# EAGLE design Charging Controller STM32 Base (EAGLE 9.6.2)
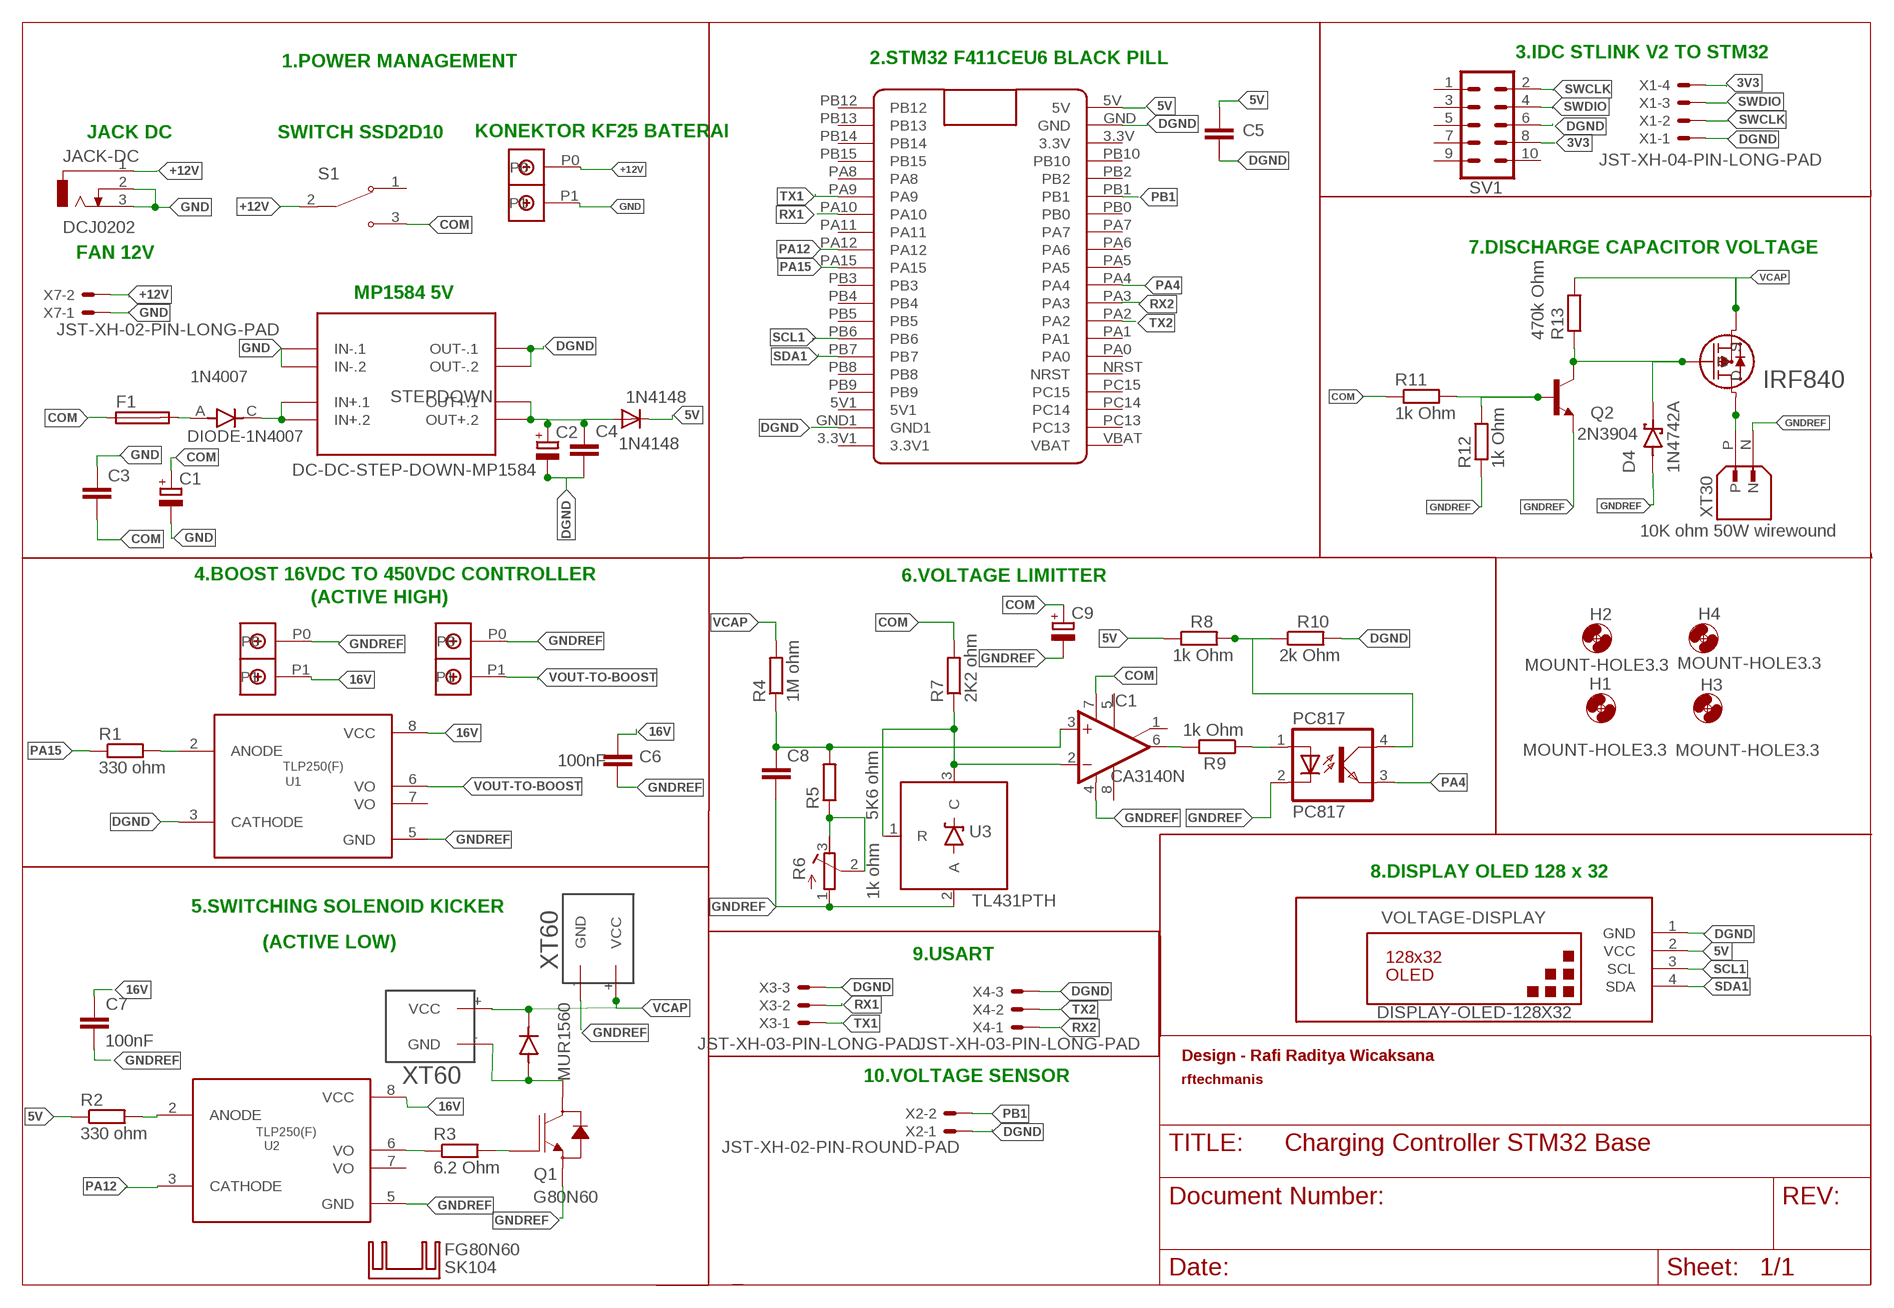
[diagram p0: schematic, sheet 1, part 1 of 2]
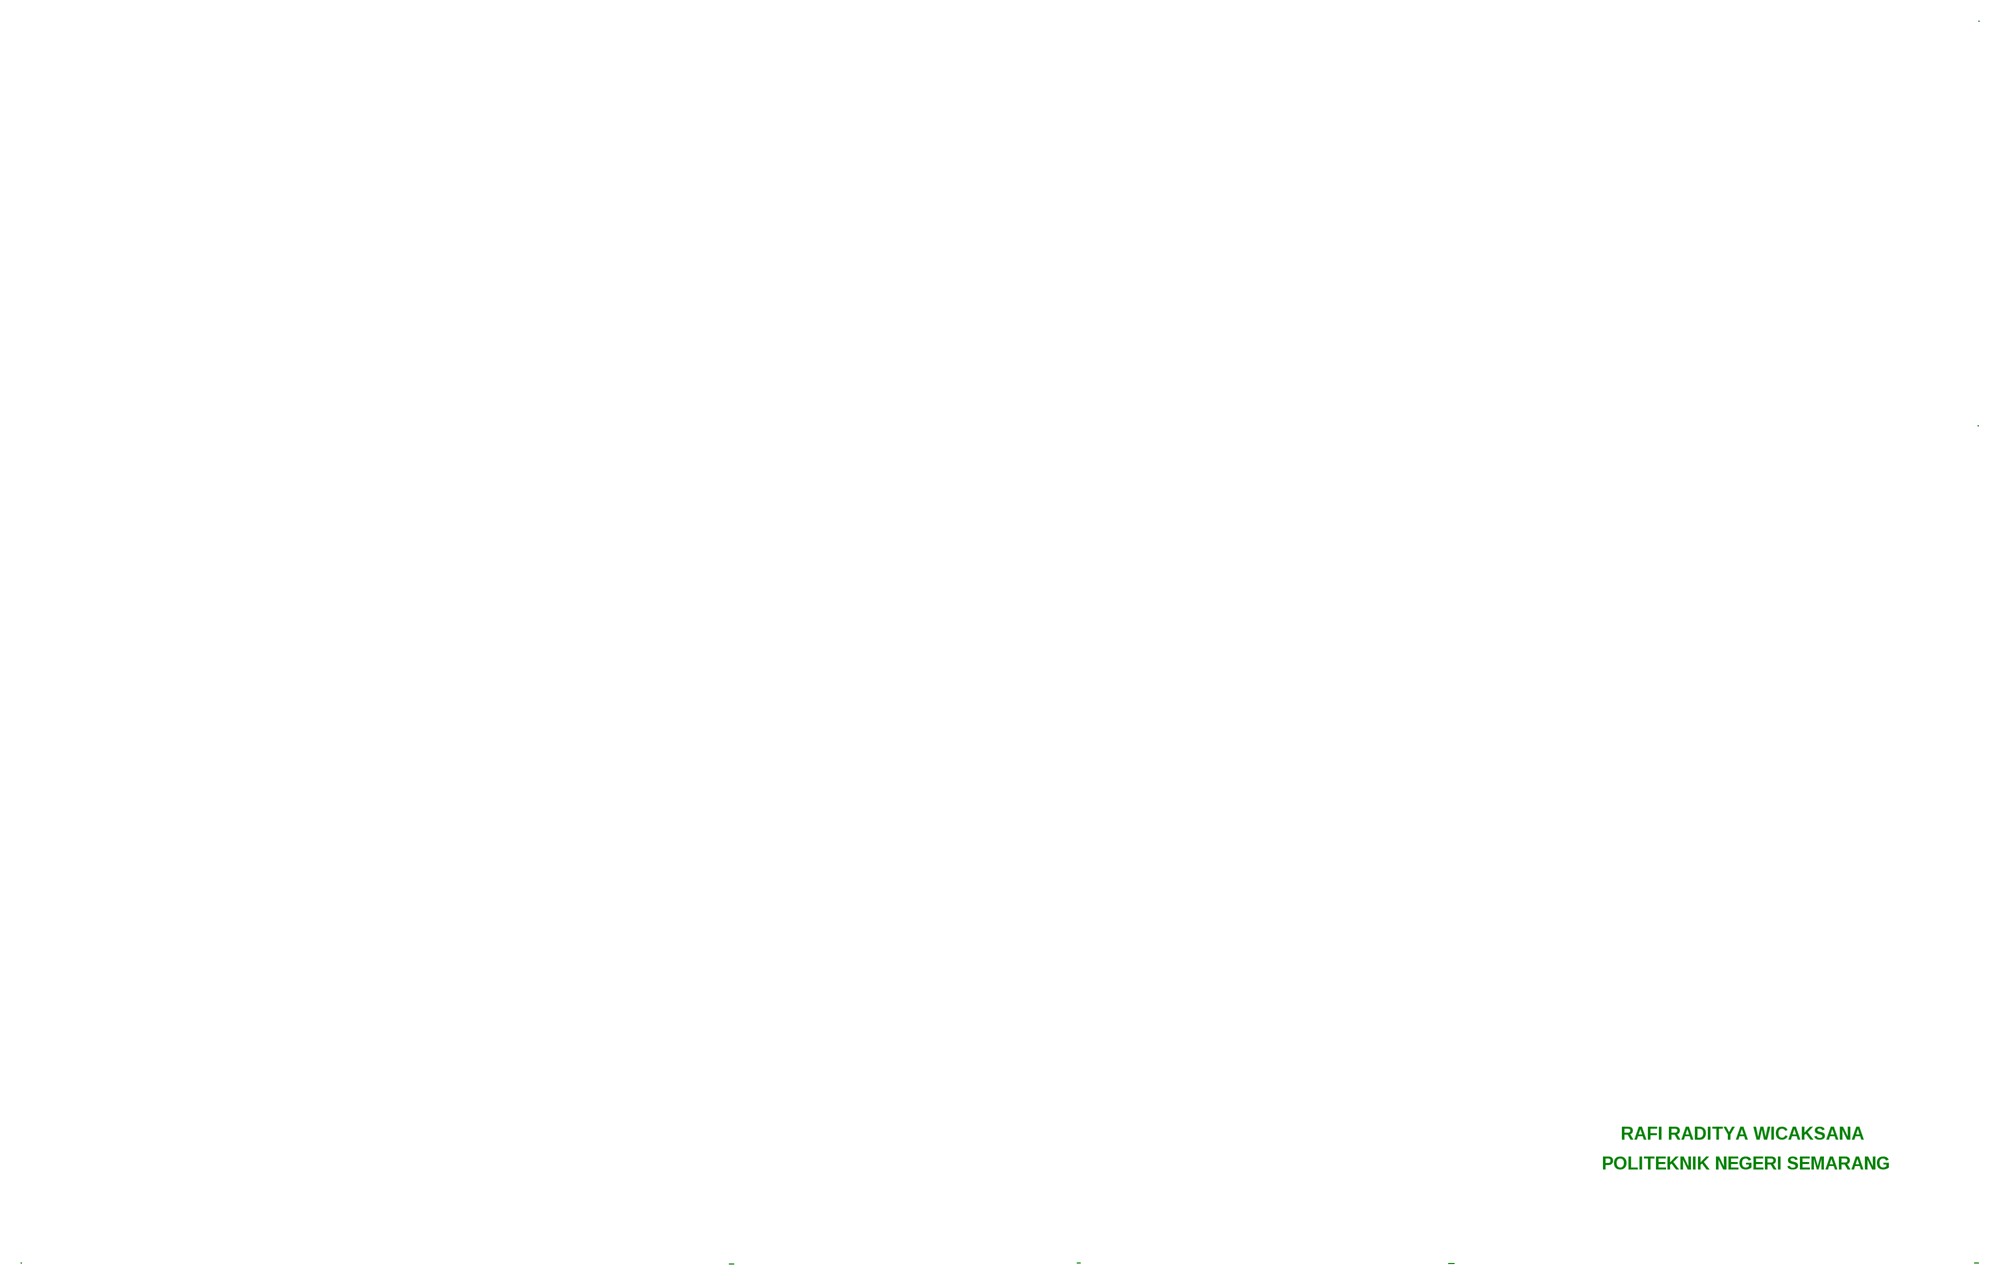
[diagram p1: schematic, sheet 1, part 2 of 2]

## Parts
1N4007  DIODE-1N4007  [DIOAD1060W80L520D270]
1N4148  1N4148  [DO35-10]
C1  CPOL-EUE3.5-8  [E3,5-8]
C2  CPOL-EUE3.5-8  [E3,5-8]
C3  C-EU050-030X075  [C050-030X075]
C4  C-EU050-030X075  [C050-030X075]
C5  C-EU050-030X075  [C050-030X075]
C6  100nF  C-EU050-030X075  [C050-030X075]
C7  100nF  C-EU050-030X075  [C050-030X075]
C8  C-EU050-035X075  [C050-035X075]
C9  CPOL-EUE2-5  [E2-5]
D4  1N4742A  [DIOAD1036W78L463D237]
F1  SH25  [SH25]
FG80N60  SK104  [SK104]
H1  MOUNT-HOLE3.3  [3,3]
H2  MOUNT-HOLE3.3  [3,3]
H3  MOUNT-HOLE3.3  [3,3]
H4  MOUNT-HOLE3.3  [3,3]
IC1  CA3140N  [DIL08]
JACK-DC  DCJ0202  [DCJ0202]
KF25_2PIN3  KF25_2PIN  [KF25_2PIN]
KF25_2PIN4  KF25_2PIN  [KF25_2PIN]
MUR1560  MUR1560  [TO508P997X444X1905-2]
PC817  PC817  [DIL04]
Q1  G80N60  [TO544P1613X521X2557-3]
Q2  2N3904  [TO92]
R1  330 ohm  R-EU_0204/7  [0204/7]
R2  330 ohm  R-EU_0204/7  [0204/7]
R3  6.2 Ohm  R-EU_0411/12  [0411/12]
R4  1M ohm  R-EU_0411/12  [0411/12]
R5  5K6 ohm  R-EU_0411/12  [0411/12]
R6  1k ohm  R-TRIMM64X  [RTRIM64X]
R7  2K2 ohm  R-EU_0207/10  [0207/10]
R8  1k Ohm  R-EU_0207/10  [0207/10]
R9  1k Ohm  R-EU_0207/10  [0207/10]
R10  2k Ohm  R-EU_0207/10  [0207/10]
R11  1k Ohm  R-EU_0204/7  [0204/7]
R12  1k Ohm  R-EU_0204/7  [0204/7]
R13  470k Ohm  R-EU_0204/7  [0204/7]
S1  1103M2S3CQE2  [SW_1103M2S3CQE2]
STEPDOWN  DC-DC-STEP-DOWN-MP1584  [DC-DC-STEP-DOWN-MP1584]
SV1  ML10  [ML10]
U1  TLP250(F)  [DIP1016W50P254L966H380Q8P]
U2  TLP250(F)  [DIP1016W50P254L966H380Q8P]
U3  TL431PTH  [TO-92]
U4  IRF840  [TO220AB_VIS]
U$2  KF25_2PIN  [KF25_2PIN]
U$3  BLACK_PILL  [BLACK_PILL]
U$4  XT60  [XT60]
U$5  XT60  [XT60]
VOLTAGE-DISPLAY  DISPLAY-OLED-128X32  [DISPLAY-OLED-128X32]
X1  JST-XH-04-PIN-LONG-PAD  [JST-XH-04-PACKAGE-LONG-PAD]
X2  JST-XH-02-PIN-ROUND-PAD  [JST-XH-02-PACKAGE-ROUND-PAD]
X3  JST-XH-03-PIN-LONG-PAD  [JST-XH-03-PACKAGE-LONG-PAD]
X4  JST-XH-03-PIN-LONG-PAD  [JST-XH-03-PACKAGE-LONG-PAD]
X7  JST-XH-02-PIN-LONG-PAD  [JST-XH-02-PACKAGE-LONG-PAD]
XT30  10K ohm 50W wirewound  XT30PW-M  [AMASS_XT30PW-M]

## Nets
3,3V: PC817.4(COL) R8.2 R10.1
3.3V: U$3.3.3V1
3V3: SV1.8 X1.4
5V: 1N4148.C C5.1 R2.1 R8.1 U$3.5V VOLTAGE-DISPLAY.2(VCC)
16V: C6.1 C7.1 KF25_2PIN3.P1 U1.8(VCC) U2.8(VCC)
+12V: JACK-DC.1 S1.2 U$2.P0 X7.2
COM: C1.+ C3.2 C9.+ F1.1 IC1.7(V+) R7.2 R11.1 S1.3
DGND: C2.- C4.2 C5.2 R10.2 STEPDOWN.OUT-.1 STEPDOWN.OUT-.2 SV1.6 U1.3(CATHODE) U$3.GND U$3.GND1 VOLTAGE-DISPLAY.1(GND) X1.1 X2.1 X3.3 X4.3
GND: C1.- C3.1 JACK-DC.2 JACK-DC.3 STEPDOWN.IN-.1 STEPDOWN.IN-.2 U$2.P1 X7.1
GNDREF: C6.2 C7.2 C8.2 C9.- D4.2(A) IC1.4(V-) KF25_2PIN3.P0 KF25_2PIN4.P0 PC817.2(C) Q1.3(E) Q2.3(E) R6.1(A) R12.1 U1.5(GND) U2.5(GND) U3.2(A) U$4.-(GND) XT30.N
N$1: 1N4007.C STEPDOWN.IN+.1 STEPDOWN.IN+.2
N$2: 1N4007.A F1.2
N$3: R1.2 U1.2(ANODE)
N$4: 1N4148.A C2.+ C4.1 STEPDOWN.OUT+.1 STEPDOWN.OUT+.2
N$5: R2.2 U2.2(ANODE)
N$6: MUR1560.3(A) Q1.2(C) U$5.-(GND)
N$7: R3.1 U2.6(VO)
N$8: Q1.1(G) R3.2
N$9: C8.1 IC1.3(+IN) R4.1 R5.2
N$10: R5.1 R6.2(S) R6.3(E)
N$11: IC1.2(-IN) R7.1 U3.1(R) U3.3(C)
N$12: IC1.6(OUT) R9.2
N$15: PC817.1(A) R9.1
N$17: Q2.2(B) R11.2 R12.2
N$18: D4.1(K) Q2.1(C) R13.1 U4.1(G)
N$19: U4.2(D) XT30.P
PA4: PC817.3(EMIT) U$3.PA4
PA12: U2.3(CATHODE) U$3.PA12
PA15: R1.1 U$3.PA15
PB1: U$3.PB1 X2.2
RX1: U$3.PA10 X3.2
RX2: U$3.PA3 X4.1
SCL1: U$3.PB6 VOLTAGE-DISPLAY.3(SCL)
SDA1: U$3.PB7 VOLTAGE-DISPLAY.4(SDA)
SWCLK: SV1.2 X1.2
SWDIO: SV1.4 X1.3
TX1: U$3.PA9 X3.1
TX2: U$3.PA2 X4.2
VCAP: MUR1560.1(K) R4.2 R13.2 U4.3(S) U$4.+(VCC) U$5.+(VCC)
VOUT-TO-BOOST: KF25_2PIN4.P1 U1.6(VO)
Unconnected: IC1.1(ON/CMP) IC1.5(ON) IC1.8(CMP) S1.1 SV1.1 SV1.3 SV1.5 SV1.7 SV1.9 SV1.10 U1.7(VO) U2.7(VO) U$3.3.3V U$3.5V1 U$3.NRST U$3.PA0 U$3.PA1 U$3.PA5 U$3.PA6 U$3.PA7 U$3.PA8 U$3.PA11 U$3.PB0 U$3.PB2 U$3.PB3 U$3.PB4 U$3.PB5 U$3.PB8 U$3.PB9 U$3.PB10 U$3.PB12 U$3.PB13 U$3.PB14 U$3.PB15 U$3.PC13 U$3.PC14 U$3.PC15 U$3.VBAT

## Notes on the sheet
- 3.IDC STLINK V2 TO STM32
- 1.POWER MANAGEMENT | 2.STM32 F411CEU6 BLACK PILL
- JACK DC | SWITCH SSD2D10 | KONEKTOR KF25 BATERAI
- FAN 12V | 7.DISCHARGE CAPACITOR VOLTAGE
- MP1584 5V
- 4.BOOST 16VDC TO 450VDC CONTROLLER | 6.VOLTAGE LIMITTER
- (ACTIVE HIGH)
- 8.DISPLAY OLED 128 x 32
- 5.SWITCHING SOLENOID KICKER
- (ACTIVE LOW)
- 9.USART
- Design - Rafi Raditya Wicaksana
- 10.VOLTAGE SENSOR | rftechmanis
- RAFI RADITYA WICAKSANA
- POLITEKNIK NEGERI SEMARANG

## Library data of the parts
1N4007 = Polirevo_2024:DIODE-1N4007: Diode Switching 1KV 1A 2-Pin DO-41 Check availability; AVAILABILITY: In Stock; CHECK_PRICES: https://www.snapeda.com/parts/1N4007/Diotec/view-part/?ref=eda; DESCRIPTION: Diode, DO-41, 1000V, 1A, 175°C; MF: Diotec Semiconductor; MP: 1N4007; PACKAGE: DO-41 Diotec; PRICE: None; SNAPEDA_LINK: https://www.snapeda.com/parts/1N4007/Diotec/view-part/?ref=snap
1N4148 = diode:1N4148: DIODE high speed (Philips)
C1 C2 C9 = rcl:CPOL-EU: POLARIZED CAPACITOR, European symbol; SPICEPREFIX: C
C3-C8 = rcl:C-EU: CAPACITOR, European symbol; SPICEPREFIX: C
D4 = 1N4742A:1N4742A: Check availability; AVAILABILITY: In Stock; CHECK_PRICES: https://www.snapeda.com/parts/1N4742A/Onsemi/view-part/?ref=eda; DESCRIPTION: Zener Diode 12 V 1 W ±5% Through Hole DO-204AL (DO-41); MF: ON; MP: 1N4742A; PACKAGE: DO-41 Fairchild Semiconductor; PRICE: None; SNAPEDA_LINK: https://www.snapeda.com/parts/1N4742A/Onsemi/view-part/?ref=snap
F1 = fuse:SH25: FUSE HOLDER grid 25 mm, OGN0031 8211, Schurter (Buerklin); MF: SCHURTER; MPN: 0031.8211; OC_FARNELL: 1162741; OC_NEWARK: 96B9380
FG80N60 = heatsink:SK104: HEATSINK manufacturer Fischer/distributor Buerklin
H1-H4 = holes:MOUNT-HOLE: MOUNTING HOLE with drill center marker
IC1 = linear:CA3140: OP AMP
JACK-DC = con-jack:DCJ0202: DC POWER JACK Source: DCJ0202.pdf; OC_FARNELL: unknown; OC_NEWARK: unknown
KF25_2PIN3 KF25_2PIN4 U$2 = KF25_2PIN:KF25_2PIN
MUR1560 = MUR1560:MUR1560: Diode Standard 600V 15A Through Hole TO-220AC Check availability; AVAILABILITY: Not in stock; CHECK_PRICES: https://www.snapeda.com/parts/MUR1560/Diotec/view-part/?ref=eda; DESCRIPTION: Diode, Superfast, TO-220AC, 600V, 15A, 50ns, 175°C; MF: Diotec Semiconductor; MP: MUR1560; PACKAGE: TO-220AC Diotec; PRICE: None; PURCHASE-URL: https://www.snapeda.com/api/url_track_click_mouser/?unipart_id=10223036&manufacturer=Diotec Semiconductor&part_name=MUR1560&search_term=mur1560; SNAPEDA_LINK: https://www.snapeda.com/parts/MUR1560/Diotec/view-part/?ref=snap
PC817 = optocoupler-2:PC817: SHARP OPTO COUPLER
Q1 = FGH80N60FDTU:G80N60: Check availability; AVAILABILITY: In Stock; CHECK_PRICES: https://www.snapeda.com/parts/IHW30N160R5XKSA1/Infineon/view-part/?ref=eda; DESCRIPTION: IGBT Trench Field Stop 1600 V 60 A 263 W Through Hole PG-TO247-3; MF: Infineon Technologies; MP: G80N60; PACKAGE: TO-247-3 Infineon Technologies; PRICE: None; SNAPEDA_LINK: https://www.snapeda.com/parts/IHW30N160R5XKSA1/Infineon/view-part/?ref=snap
Q2 = transistor-npn:2N3904: NPN Transistor
R1-R5 R7-R13 = rcl:R-EU_: RESISTOR, European symbol; SPICEPREFIX: R
R6 = rcl:R-TRIMM: Trimm resistor; SPICEMODEL: X; SPICEPREFIXL: POT
S1 = Slide-Switch1103M23CQE2:1103M2S3CQE2: Check availability Check availability; AVAILABILITY: In Stock; CHECK_PRICES: https://www.snapeda.com/parts/1103M2S3CQE2/C%2526K/view-part/?ref=eda; DESCRIPTION: Slide Switch SPDT Through Hole; MF: C&K; MP: 1103M2S3CQE2; PACKAGE: None; PRICE: None; SNAPEDA_LINK: https://www.snapeda.com/parts/1103M2S3CQE2/C%2526K/view-part/?ref=snap
STEPDOWN = diy-modules:DC-DC-STEP-DOWN-MP1584: DC/DC Step-Down Regulator based on MP1584 chip MP1584 datasheet available here: http://www.haoyuelectronics.com/Attachment/MP1584/MP1584.pdf Click here to find device on ebay.com
SV1 = con-harting-ml:ML10: HARTING; OC_FARNELL: unknown; OC_NEWARK: unknown
U1 U2 = TLP250_F_:TLP250(F): Optocoupler; THT; Out: IGBT driver; 2.5kV; DIP8; 1.5A Check availability; AVAILABILITY: In Stock; CHECK_PRICES: https://www.snapeda.com/parts/TLP250(F)/Toshiba+Semiconductor+and+Storage/view-part/?ref=eda; DESCRIPTION: 1.5A Gate Driver Optical Coupling 2500Vrms 1 Channel 8-DIP; MF: Toshiba; MP: TLP250(F); PACKAGE: DIP-8 Toshiba; PRICE: None; SNAPEDA_LINK: https://www.snapeda.com/parts/TLP250(F)/Toshiba+Semiconductor+and+Storage/view-part/?ref=snap
U3 = TL431:TL431: Check availability; AVAILABILITY: Not in stock; CHECK_PRICES: https://www.snapeda.com/parts/TL431/Onsemi/view-part/?ref=eda; DESCRIPTION: IC VREF SHUNT ADJ 0.4% TO92-3; MF: onsemi; MP: TL431; PACKAGE: None; PRICE: None; SNAPEDA_LINK: https://www.snapeda.com/parts/TL431/Onsemi/view-part/?ref=snap
U4 = IRF840:IRF840; COPYRIGHT: Copyright (C) 2026 Ultra Librarian. All rights reserved.; MANUFACTURER_NAME: Vishay; MANUFACTURER_PART_NUMBER: IRF840
U$3 = STM32-F4-BlackPill:BLACK_PILL: STM32F401CC and STM32f411CE based WeAct Black Pill (rev 3.0)
U$4 U$5 = XT60:XT60: XT60
VOLTAGE-DISPLAY = diy-modules:DISPLAY-OLED-128X32: 128x32 Dot Matrix OLED Module with I2C interface based on SSD1306 chip More details available here: http://www.tinyosshop.com/index.php?route=product/product&product_id=953 Schematic available here: http://www.tinyosshop.com/datasheet/OLED%2012832.pdf SSD1306 datasheet: https://cdn-shop.adafruit.com/datasheets/SSD1306.pdf Click here to find device on ebay.com
X1 = JST XH Connectors v1-0:JST-XH-04-PIN: JST XH Connector 2 Pin Wire to board connector. Pitch: 2,54 mm, (0.100") Number of pins: 4 Created by Rembrandt Electronics www.rembrandtelectronics.com
X2 X7 = JST XH Connectors v1-0:JST-XH-02-PIN: JST XH Connector 2 Pin Wire to board connector. Pitch: 2,54 mm, (0.100") Number of pins: 2 Created by Rembrandt Electronics www.rembrandtelectronics.com
X3 X4 = JST XH Connectors v1-0:JST-XH-03-PIN: JST XH Connector 2 Pin Wire to board connector. Pitch: 2,54 mm, (0.100") Number of pins: 3 Created by Rembrandt Electronics www.rembrandtelectronics.com
XT30 = XT30PW-M:XT30PW-M: Check availability; AVAILABILITY: In Stock; CHECK_PRICES: https://www.snapeda.com/parts/XT30PW-M/AMASS/view-part/?ref=eda; DESCRIPTION: Socket; DC supply; XT30; male; PIN: 2; on PCBs; THT; Colour: yellow; MF: AMASS; MP: XT30PW-M; PACKAGE: None; PRICE: None; SNAPEDA_LINK: https://www.snapeda.com/parts/XT30PW-M/AMASS/view-part/?ref=snap

## Board
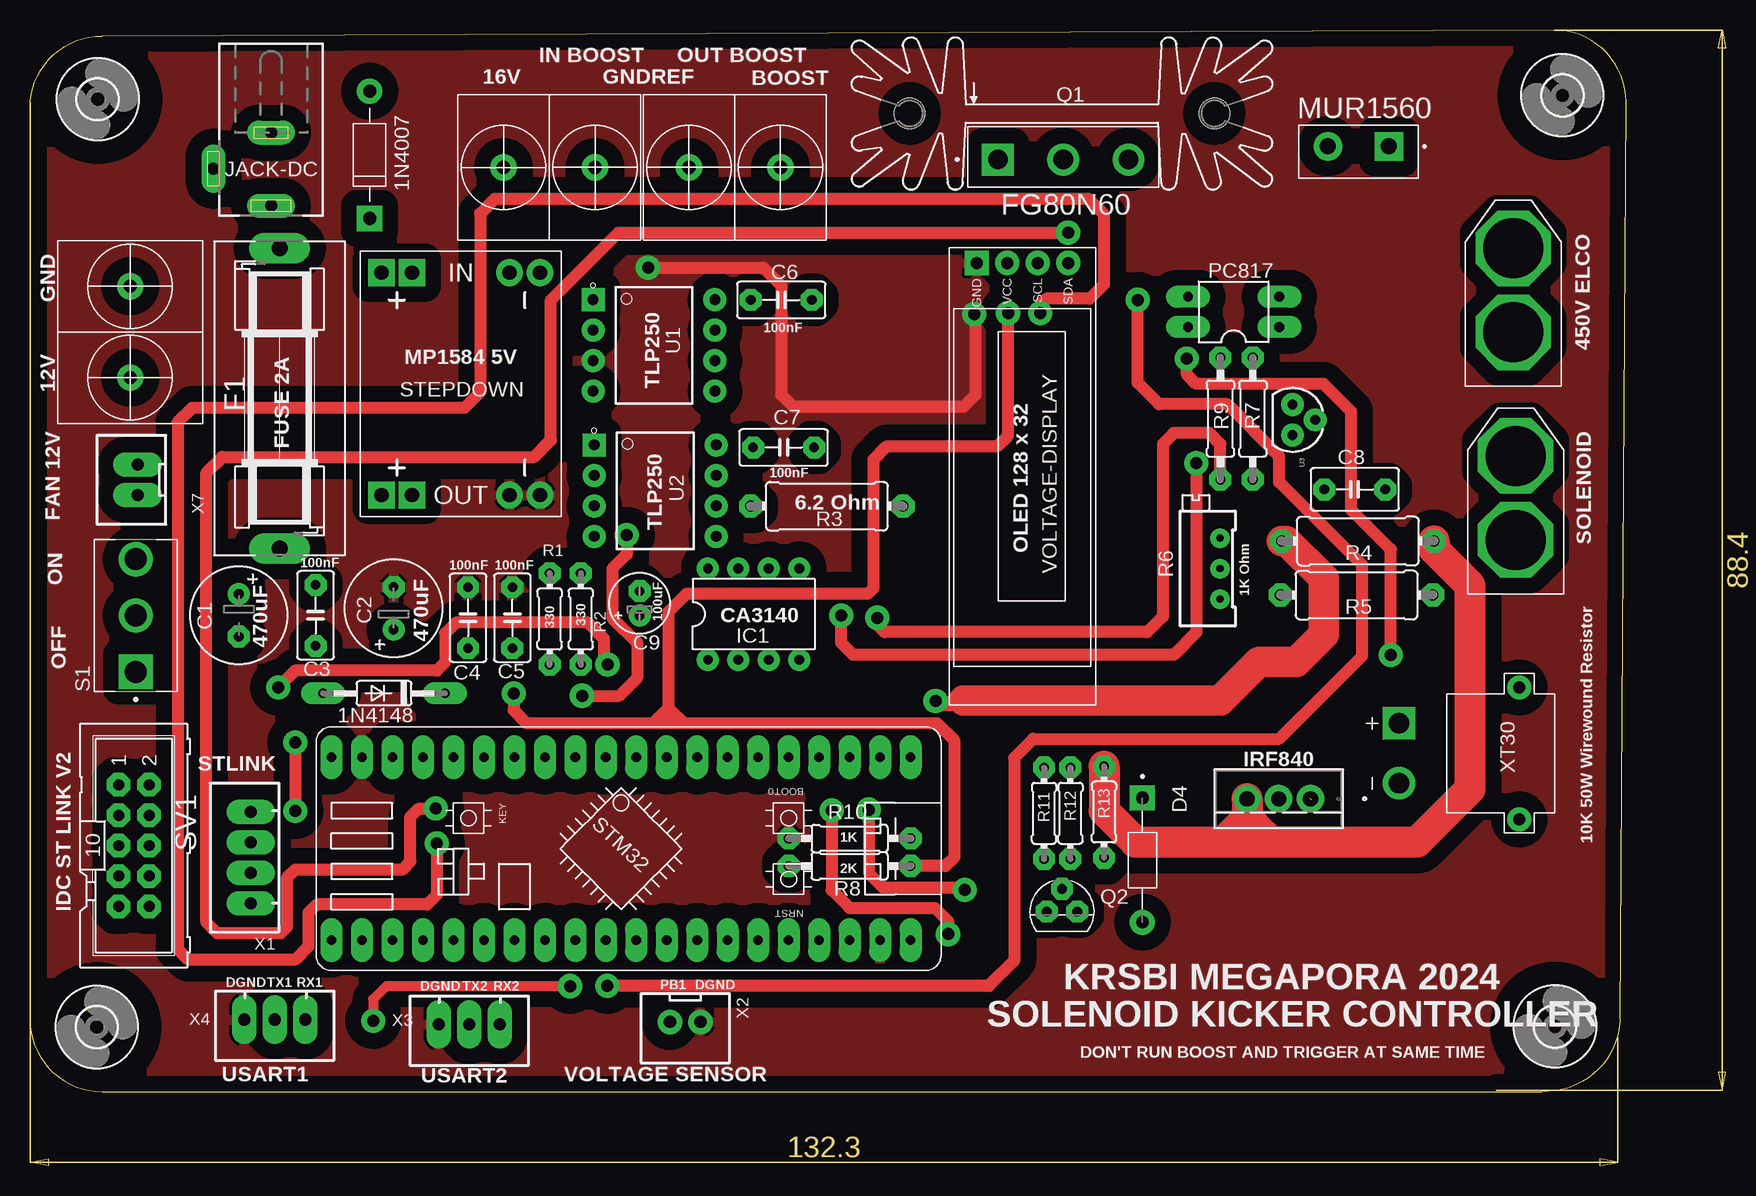
[diagram p2: board, top side]
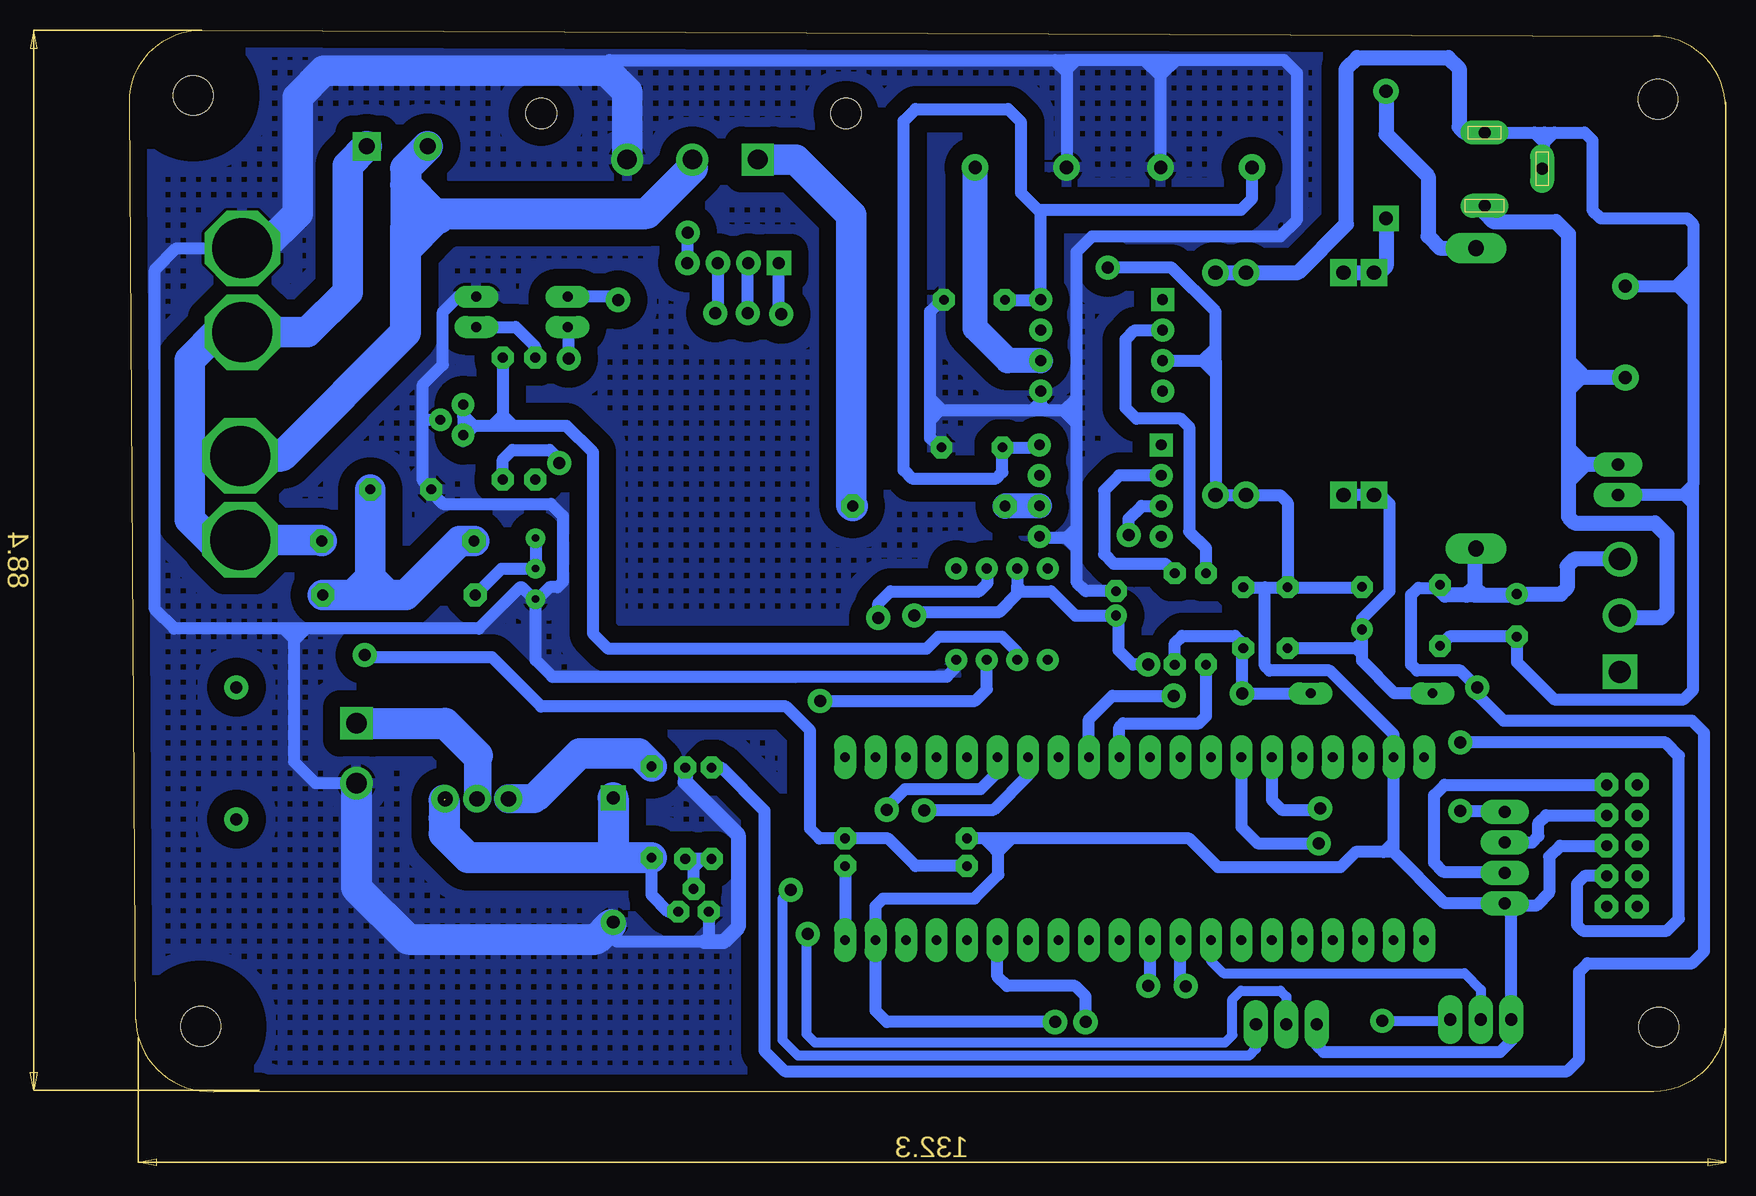
[diagram p3: board, bottom side, seen from below]

Size 133 x 88.5 mm. Coordinates in mm from the lower left corner, seen from the top.
Outline: 6,0 126,0 arc90 132.5,6 133,82.5 arc90 127,88.5 6,88 arc90 0,82 0,6 arc90 6,0
Copper layers (1*16): Top 0.035mm / dielectric 1.5mm / Bottom 0.035mm
Design rules "default *": minimum track width 6mil, minimum drill 0.35mm, track to track 6mil, track to pad 6mil, pad to pad 6mil, via to via 6mil, smd to smd 6mil, copper to edge 40mil, drill to drill 6mil, minimum pad ring 20mil, minimum via ring 20mil, stop-mask expansion 4mil, vias tented up to drill 0mil, thermal gap 10mil

### Footprints (pad centres in the part's own frame; a part is rotated, then mirrored left to right if it is on the bottom)
DIOAD1060W80L520D270 = drill 1.1 pad 1.65: A 5.3,0 | drill 1.1 pad 1.65 square: C -5.3,0
DO35-10 = drill 0.813 long: A 5.08,0; C -5.08,0
E3,5-8 = drill 0.813 pad 1.6: + -1.778,0 | drill 0.813 pad 1.6 octagon: - 1.778,0
C050-030X075 = drill 0.813 octagon: 1 -2.54,0; 2 2.54,0
C050-035X075 = drill 0.813 octagon: 1 -2.54,0; 2 2.54,0
E2-5 = drill 0.813 pad 1.27: + -1.016,0 | drill 0.813 pad 1.27 octagon: - 1.016,0
DIOAD1036W78L463D237 = drill 1.06 pad 1.59 square: 1 -5.18,0 | drill 1.06 pad 1.59: 2 5.18,0
SH25 = drill 1.321 pad 2.54 long: 1 -12.522,0; 2 12.522,0
SK104 = hole 2.54: -12.7,-0.762; 12.7,-0.762
3,3 = hole 3.3: 0,0
DIL08 = drill 0.813 pad 1.27: 1 -3.81,-3.81; 2 -1.27,-3.81; 3 1.27,-3.81; 4 3.81,-3.81; 5 3.81,3.81; 6 1.27,3.81; 7 -1.27,3.81; 8 -3.81,3.81
DCJ0202 = drill 1 pad 2 long: 1 0,3.1; 2 4.8,0; 3 0,-3
KF25_2PIN = drill 1.1 pad 2.2: P0 3.82,6.05; P1 11.44,6.05
TO508P997X444X1905-2 = drill 1.34 pad 2.01 square: 1 -2.54,0 | drill 1.34 pad 2.01: 3 2.54,0
DIL04 = drill 0.813 long: 1 -1.27,-3.81; 2 1.27,-3.81; 3 1.27,3.81; 4 -1.27,3.81
TO544P1613X521X2557-3 = drill 1.64 pad 2.46 square: 1 -5.44,0 | drill 1.64 pad 2.46: 2 0,0; 3 5.44,0
TO92 = drill 0.813 octagon: 1 1.27,0; 2 0,1.905; 3 -1.27,0
0204/7 = drill 0.813 octagon: 1 -3.81,0; 2 3.81,0
0411/12 = drill 0.914 octagon: 1 -6.35,0; 2 6.35,0
RTRIM64X = drill 0.61: 1 1.27,-2.54; 2 1.27,0; 3 1.27,2.54
0207/10 = drill 0.813 octagon: 1 -5.08,0; 2 5.08,0
SW_1103M2S3CQE2 = drill 1.85 square: 1 -4.7,0 | drill 1.85: 2 0,0; 3 4.7,0
DC-DC-STEP-DOWN-MP1584 = drill 1.2 pad 2 square: IN+.1 -9.271,-4.064; IN+.2 -9.271,-6.604; OUT+.1 9.271,-4.064; OUT+.2 9.271,-6.604 | drill 1.2 pad 2: IN-.1 -9.271,6.604; IN-.2 -9.271,4.064; OUT-.1 9.271,6.604; OUT-.2 9.271,4.064
ML10 = drill 0.914 octagon: 1 -5.08,-1.27; 2 -5.08,1.27; 3 -2.54,-1.27; 4 -2.54,1.27; 5 0,-1.27; 6 0,1.27; 7 2.54,-1.27; 8 2.54,1.27; 9 5.08,-1.27; 10 5.08,1.27
DIP1016W50P254L966H380Q8P = drill 0.9 pad 1.5 square: 1 -5.08,3.81 | drill 0.9 pad 1.5: 2 -5.08,1.27; 3 -5.08,-1.27; 4 -5.08,-3.81; 5 5.08,-3.81; 6 5.08,-1.27; 7 5.08,1.27; 8 5.08,3.81
TO-92 = drill 0.813 pad 1.88: 1 -1.27,0; 2 0,1.905; 3 1.27,0
TO220AB_VIS = drill 1.27 pad 1.778: 1 0,0; 2 2.642,0; 3 5.283,0
BLACK_PILL = drill 0.8 long: 3.3V 7.62,10.16; 3.3V1 -7.62,-33.02; 5V 7.62,15.24; 5V1 -7.62,-27.94; GND 7.62,12.7; GND1 -7.62,-30.48; NRST 7.62,-22.86; PA0 7.62,-20.32; PA1 7.62,-17.78; PA2 7.62,-15.24; PA3 7.62,-12.7; PA4 7.62,-10.16; PA5 7.62,-7.62; PA6 7.62,-5.08; PA7 7.62,-2.54; PA8 -7.62,5.08; PA9 -7.62,2.54; PA10 -7.62,0; PA11 -7.62,-2.54; PA12 -7.62,-5.08; PA15 -7.62,-7.62; PB0 7.62,0; PB1 7.62,2.54; PB2 7.62,5.08; PB3 -7.62,-10.16; PB4 -7.62,-12.7; PB5 -7.62,-15.24; PB6 -7.62,-17.78; PB7 -7.62,-20.32; PB8 -7.62,-22.86; PB9 -7.62,-25.4; PB10 7.62,7.62; PB12 -7.62,15.24; PB13 -7.62,12.7; PB14 -7.62,10.16; PB15 -7.62,7.62; PC13 7.62,-30.48; PC14 7.62,-27.94; PC15 7.62,-25.4; VBAT 7.62,-33.02
XT60 = drill 5 octagon: + 4.5,0; - 11.5,0
DISPLAY-OLED-128X32 = drill 1 square: 1 -17.78,-3.81 | drill 1: 2 -17.78,-1.27; 3 -17.78,1.27; 4 -17.78,3.81
JST-XH-04-PACKAGE-LONG-PAD = drill 1.016 long: 1 -3.81,0; 2 -1.27,0; 3 1.27,0; 4 3.81,0
JST-XH-02-PACKAGE-ROUND-PAD = drill 1.016: 1 -1.27,0; 2 1.27,0
JST-XH-03-PACKAGE-LONG-PAD = drill 1.016 long: 1 -2.54,0; 2 0,0; 3 2.54,0
JST-XH-02-PACKAGE-LONG-PAD = drill 1.016 long: 1 -1.27,0; 2 1.27,0
AMASS_XT30PW-M = drill 1.7: N 2.5,-10 | drill 1.7 square: P -2.5,-10 | drill 1: S1 5.5,0; S2 -5.5,0

### Placement (x,y rotation side)
1N4007  28.3,78.1 90 top
1N4148  29.5,33.2 180 top
C1  17.4,39.7 270 top
C2  30.3,40.3 90 top
C3  23.8,39.7 90 top
C4  36.5,39.5 90 top
C5  40.2,39.5 90 top
C6  62.6,66 0 top
C7  62.8,53.7 0 top
C8  110.4,50.2 180 top
C9  50.8,40.7 90 top
D4  92.7,19.3 270 top
F1  20.8,57.8 90 top
FG80N60  86,82.3 0 top
H1  5.64,82.73 0 top
H2  127.7,83.05 0 top
H3  5.56,5.37 0 top
H4  127.08,5.43 0 top
IC1  60.3,39.8 0 top
JACK-DC  20.09,76.94 180 top
KF25_2PIN3  50.9,83.1 180 top
KF25_2PIN4  51.1,71 0 top
MUR1560  110.7,78.8 180 top
PC817  100.3,65 90 top
Q1  86.1,77.7 0 top
Q2  86,15 0 top
R1  43.3,39.4 90 top
R2  45.9,39.4 90 top
R3  66.4,48.8 0 top
R4  110.65,45.9 0 top
R5  110.55,41.4 0 top
R6  97.9,43.6 0 top
R7  101.9,56.1 270 top
R8  68.3,18.8 180 top
R9  99.2,56.1 270 top
R10  68.3,21.1 180 top
R11  84.5,23.2 270 top
R12  86.7,23.2 270 top
R13  89.5,23.3 90 top
S1  8.81,39.69 90 top
STEPDOWN  35.9,59 270 top
SV1  8.65,20.5 270 top
U1  52,62.2 0 top
U2  52.1,50.1 0 top
U3  105.2,56 270 top
U4  106.7,24.4 180 top
U$2  14.4,55.7 90 top
U$3  58.14,20.25 270 top
U$4  123.6,58.8 90 top
U$5  123.8,41.5 90 top
VOLTAGE-DISPLAY  82.7,51.3 270 top
X1  18.4,19.5 90 top
X2  54.6,5.8 180 top
X3  36.6,5.6 180 top
X4  20.4,6 180 top
X7  8.97,51 90 top
XT30  124.1,28.2 270 top

### Tracks (layer width: path | path; a pad name or v marks a point on that pad's centre or on a via)
3,3V  (via drill 1)
  Top 1.016: v113.4,36.4 113.4,45.2 110.1,48.5 110.1,56.7 107.8,59 97.2,59 96.4,59.8 v96.4,61.1
  Bottom 1.016: R8.2 67.5,18.8 69.8,21.1 R10.1 75.5,21.1 76.3,21.9 76.3,30.1 78.3,32.1 98.7,32.1 102.8,36.2 113.2,36.2 v113.4,36.4 | v96.4,61.1 96.4,63.64 PC817.4
3V3  (via drill 1)
  Top 1.016: v22.1,29.1 v22.1,23.4
  Bottom 1.016: SV1.8 11.74,17.96 12.4,17.3 12.4,13.9 11.9,13.4 4.9,13.4 3.9,14.4 3.9,28 5,29.1 v22.1,29.1 | v22.1,23.4 18.49,23.4 X1.4
5V  (via drill 1)
  Top 1.016: 54.5,30.7 75.6,30.7 77,29.3 77,19.5 76.3,18.8 R8.1 | 54.5,30.7 53.2,30.7 | 53.2,30.7 51.9,30.7 | 51.9,30.7 41.4,30.7 40.3,31.8 v40.3,33.2 | 53.2,30.7 53.2,32 | 53.2,32 53.2,40 54.7,41.5 69.8,41.5 70.3,42 70.3,52.7 71.4,53.8 80.6,53.8 81.5,54.7 v81.5,64.9 | 53.2,32 51.9,30.7 | 53.2,32 54.5,30.7
  Bottom 1.016: U$3.5V 73.48,12.73 73.48,12.18 73.4,12.1 73.38,12.12 R8.1 | 1N4148.C v40.3,33.2 40.3,36.86 | 40.3,36.86 C5.1 | R2.1 45.9,37.4 45.3,38 40.9,38 40.3,37.4 40.3,36.86 | v81.5,64.9 81.5,69.01 VOLTAGE-DISPLAY.2
16V
  Bottom 1.016: KF25_2PIN3.P1 39.46,74.44 40.4,73.5 57.3,73.5 | 57.3,73.5 58.7,74.9 58.7,80.8 59.8,81.9 67.5,81.9 68.5,80.9 68.5,51.8 67.81,51.11 60.79,51.11 60.26,51.64 C7.1 57.39,53.7 U2.8 | 57.3,73.5 57.08,73.28 U1.8 C6.1
+12V
  Bottom 1.27: U$2.P0 12.1,59.52 | 13.1,59.52 12.1,59.52 | 13.1,59.52 13.1,58.6 | 13.1,58.6 13.1,53.6 | 13.1,53.6 13.1,52.27 | 13.1,52.27 11.77,52.27 | X7.2 11.73,52.27 | JACK-DC.1 20.09,73.24 19.39,72.54 14.14,72.54 13.1,71.5 13.1,60.9 | 13.1,60.9 13.1,59.52 | 13.1,52.27 13.1,50.9 | 12.1,59.52 12.1,59.9 13.1,60.9 | 12.1,59.52 13.02,58.6 13.1,58.6 | 11.73,52.27 11.77,52.27 | 11.77,52.27 13.1,53.6 | 11.73,52.27 13.1,50.9 | 13.1,50.9 13.1,47.9 12.6,47.4 5.9,47.4 4.9,46.4 4.9,40 5.4,39.5 8.62,39.5 S1.2
COM  (via drill 1)
  Top 1.016: v48.13,35.6 47.83,35.9 47.83,37.77 46.5,39.1 35.5,39.1 34.6,38.2 34.6,35.8 33.9,35.1 22.1,35.1 v20.7,33.7 | v97.2,52.4 97.2,38.3 95.3,36.4 68.6,36.4 67.6,37.4 v67.6,39.7
  Bottom 1.016: 23.8,41.8 24,42 25.6,42 26.2,41.4 26.2,35.6 25.7,35.1 22.1,35.1 v20.7,33.7 20.7,33.1 18.5,30.9 2.8,30.9 1.8,29.9 1.8,11.7 2.8,10.7 11.5,10.7 12.2,10 12.2,2.7 13.2,1.7 78.4,1.7 80.1,3.4 80.1,23.41 83.7,27.01 R11.1 | R7.2 101.9,52.7 101.1,53.5 98,53.5 97.2,52.7 v97.2,52.4 | v48.13,35.6 49.4,35.6 50.6,36.8 50.6,39.48 C9.+ 54.18,39.68 56.2,41.7 58.6,41.7 59.03,42.13 | IC1.7 59.03,42.13 | v67.6,39.7 67.3,40 60.5,40 59.03,41.47 59.03,42.13
  Bottom 1.27: 20.9,41.38 20.3,41.38 | 20.9,41.98 20.9,45.18 F1.1 | 20.9,41.98 20.9,41.38 | S1.3 12.61,44.39 13.2,43.8 13.2,42 13.72,41.48 C1.+ 17.5,41.38 20.3,41.38 | 20.9,41.38 21.6,41.38 | 21.6,41.38 23.38,41.38 23.8,41.8 C3.2 | 20.3,41.38 20.9,41.98 | 20.9,41.98 21,41.98 21.6,41.38
DGND  (via drill 1)
  Top 1.016: v51.5,68.7 61.1,68.7 62.6,67.2 62.6,58.1 63.6,57.1 77.8,57.1 78.8,58.1 78.8,64.8 v78.7,64.8
  Bottom 1.016: C5.2 38.4,42.04 | 38.4,42.04 C4.2 | C4.2 30.34,42.04 C2.- | C4.2 36.5,49.1 37.13,49.73 STEPDOWN.OUT-.2 STEPDOWN.OUT-.1 42.5,60 | 38.4,42.04 38.4,35.5 38,35.1 33,35.1 27.66,29.76 U$3.GND1 27.66,20.8 | 18.59,15.5 X1.1 23.39,15.69 27.66,19.96 | SV1.6 13.8,20.5 14.7,19.6 14.7,16.6 15.8,15.5 18.59,15.5 | U1.3 43.6,60.93 | 42.5,60.93 43.6,60.93 | 42.5,60.93 42.5,60 | 42.5,60.93 42.5,62.03 | 42.5,62.03 42.5,65 46.2,68.7 v51.5,68.7 | v78.7,64.8 78.89,64.99 VOLTAGE-DISPLAY.1 | 43.6,60.93 42.5,62.03 | 43.6,60.93 42.67,60 42.5,60 | X3.3 34.06,3.86 33.5,3.3 18.8,3.3 17.86,4.24 X4.3 17.86,14.77 18.59,15.5 | 27.66,19.96 27.66,20.8 | 27.66,19.96 28.5,19.96 | 28.5,19.96 30.84,19.96 32.1,18.7 42.3,18.7 44.7,21.1 59.5,21.1 | 59.5,21.1 60.6,21.1 | 60.6,21.1 61.8,21.1 | 61.8,21.1 R10.2 | 27.66,20.8 28.5,19.96 | 60.6,20.1 60.6,18.1 62.6,16.1 70.2,16.1 70.84,15.46 U$3.GND 70.84,6.74 69.9,5.8 X2.1 | 60.6,20.1 60.6,21.1 | 59.5,21.1 60.5,20.1 60.6,20.1 | 61.8,21.1 60.8,20.1 60.6,20.1
  pour Top (isolate 1.32): 3.48,88.52 arc90 4,88 128,88 arc-90 133,83 133,81 arc90 132.5,80.5 132.5,5.5 arc-90 127,0 5,0 arc-90 0,5 0,85.29
GND
  Bottom 1.016: JACK-DC.3 15.94,79.94 | 15.94,79.94 15.1,79.94 | 15.1,79.1 15.1,77.13 JACK-DC.2 | 15.1,79.1 15.1,79.94 | 15.1,79.94 14.26,79.94 | 14.26,79.94 11.74,79.94 11.1,79.3 11.1,73.5 10.4,72.8 3.2,72.8 2.7,72.3 2.7,68.6 | 2.7,68.6 2.7,67.1 | 2.7,67.1 2.7,65.8 | 2.7,65.8 2.7,50.6 | 2.7,50.6 3.57,49.73 | 3.57,49.73 X7.1 | U$2.P1 4.16,67.14 | 4.04,67.14 2.74,67.14 2.7,67.1 | 14.26,79.94 15.1,79.1 | 15.94,79.94 15.1,79.1 | 2.7,68.6 4.16,67.14 | 4.16,67.14 4.04,67.14 | 4.04,67.14 2.7,65.8 | 2.7,49 2.7,33.5 3.5,32.7 14.3,32.7 17.4,35.8 C1.- 23.04,37.92 C3.1 | 2.7,49 2.7,50.6 | 3.57,49.73 3.43,49.73 2.7,49
  Bottom 1.27: STEPDOWN.IN-.1 STEPDOWN.IN-.2 35.63,68.27 31.6,72.3 31.6,85.3 30.7,86.2 23.1,86.2 22.2,85.3 22.2,80.4 21.8,80 20.15,80 JACK-DC.3
GNDREF
  Bottom 1.016: 54.92,86 54.92,85.18 | 54.92,85.02 KF25_2PIN4.P0 | 45.8,86 36.8,86 35.7,84.9 35.7,72.7 37.1,71.3 52.8,71.3 54.1,70 54.1,57.7 | 45.8,86 47.1,86 | 47.1,86 48.4,86 | 48.4,86 54.1,86 | 54.1,86 54.92,86 | 55,46.2 57.09,46.2 U2.5 | 54.9,46.2 54.1,46.2 | 66.3,56.8 65.5,56.8 | 65.3,56.8 57.8,56.8 | 57.8,56.8 57.2,56.8 | 66.3,56.8 66.3,57.8 | U1.5 57.2,58.27 57.2,56.8 | 54.1,57.7 54.1,56.9 | 54.1,56.9 54.1,55.7 | 54.1,55.7 54.1,47 | 54.1,47 54.1,46.2 | 57.2,56.8 56.6,56.8 | 56.6,56.8 55.1,56.8 | 55.1,56.8 54.2,56.8 54.1,56.9 | U1.5 57.08,57.28 56.6,56.8 | U1.5 57.08,57.52 57.8,56.8 | 55.1,56.8 54.2,57.7 54.1,57.7 | 55.1,56.8 55.1,56.7 54.1,55.7 | 93.29,85.09 93.29,85.71 93,86 55.9,86 | 55.9,86 54.92,86 | 54.1,86 54.92,85.18 | 54.92,85.18 54.92,85.02 | 55.9,86 54.92,85.02 | KF25_2PIN3.P0 47.08,84.72 | 47.08,84.72 47.08,85.98 47.1,86 | 45.8,86 47.08,84.72 | 48.4,86 47.12,84.72 47.08,84.72 | C7.2 65.54,53.7 66.3,54.46 66.3,56 | 66.3,56 66.3,56.8 | 65.3,56.8 65.5,56.8 | 65.5,56.8 66.3,56 | 66.3,57.8 65.3,56.8 | R6.1 99.33,41.06 | 118.3,38.6 103.9,38.6 100.44,42.06 100.33,42.06 99.33,41.06 | 118.3,38.6 119.3,38.6 | 119.3,38.6 120.2,38.6 | 120.2,38.6 129.3,38.6 130.9,40.2 130.9,68.5 129.1,70.3 U$4.- | 99,41.06 R6.1 | C9.- 53.32,41.72 54.1,42.5 54.1,45.5 | 54.1,46.2 54.1,45.5 | 54.9,46.2 55,46.2 | 54.9,46.2 54.1,47 | 55,46.2 54.3,45.5 54.1,45.5 | U3.2 108.56,56 | 108.56,56 108.56,50.9 C8.2 107.86,49.96 106.9,49 97.9,49 96.9,48 96.9,42.5 97.34,42.06 98,42.06 99,41.06 | 108.56,56 108.56,58.94 106.9,60.6 106.9,65 105.63,66.27 PC817.2 | IC1.4 64.31,36.19 64.31,35.19 64.9,34.6 97.8,34.6 99.17,35.97 99.17,40.9 | 99.17,40.9 R6.1 | 99,41.06 99.16,40.9 99.17,40.9
  Bottom 1.016: 99.33,41.06 99.17,40.9 | Q2.3 84.73,12.87 85.1,12.5 92.4,12.5 92.9,13 92.9,13.92 D4.2 | XT30.N 117.5,25.7 119.3,27.5 119.3,37.7 | 119.3,37.7 119.3,38.6 | 118.3,38.6 119.2,37.7 119.3,37.7 | 120.2,38.6 119.3,37.7 | C6.2 65.34,66 66.3,65.04 66.3,57.8
  Bottom 1.27: R12.1 86.7,25.8 82.3,21.4 82.3,13.7 83.5,12.5 85.1,12.5
  Bottom 2.54: Q1.3 91.54,83.34 93.29,85.09 116.81,85.09 119,82.9 119,73.2 121.9,70.3 U$4.-
  Bottom 2.6: XT30.N 114.1,17 109.8,12.7 94.12,12.7 92.9,13.92
  pour Bottom (isolate 1.422, hatched): 5.5,88 128.5,88 arc-90 132.5,84 132.5,5.5 arc-90 127.5,0.5 3.5,0.5 arc-90 0,4 0,9.5 0,82.5 arc-90
N$1
  Bottom 1.27: STEPDOWN.IN+.1 STEPDOWN.IN+.2 29.23,68.2 28.9,68.2 28.3,68.8 1N4007.C
N$2
  Bottom 1.27: F1.2 23.82,70.32 24.8,71.3 24.8,76.3 28.3,79.8 1N4007.A
N$3
  Bottom 1.016: U1.2 49.23,63.47 50,62.7 50,57 49.1,56.1 45.4,56.1 44.7,55.4 44.7,46.7 43.3,45.3 R1.2
N$4
  Bottom 1.016: STEPDOWN.OUT+.1 STEPDOWN.OUT+.2 28.73,49.73 28,49 28,41.72 30.3,39.42 C2.+ | C4.1 30.84,36.96 | C2.+ 30.3,37.5 30.84,36.96 | 1N4148.A 27.6,33.2 30.3,35.9 30.3,36.42 | 30.3,36.42 C2.+ | 30.84,36.96 30.3,36.42
N$5
  Bottom 1.016: U2.2 50.53,51.37 51.8,50.1 51.8,44.8 51.01,44.01 46.7,44.01 R2.2
N$6
  Bottom 2.6: U$5.- 120.3,53 110,63.3 110,70.2 | 110,70.2 110,72 | 110,72 109.2,72.8 107.4,72.8 | Q1.2 86.1,77 89.9,73.2 107.6,73.2 | MUR1560.3 110,76.96 110,75.6 | 110,75.6 110,72 | 110,75.6 107.6,73.2 | 107.6,73.2 107.2,72.8 107.4,72.8 | 107.4,72.8 110,70.2
N$7
  Bottom 2.1: U2.6 60.02,48.83 R3.1
N$8
  Bottom 2.54: Q1.1 77.5,77.7 72.85,73.05 72.85,48.9 R3.2
N$9  (via drill 1)
  Top 1.016: 77.8,32.6 77.5,32.3 | 75.73,32.3 v75.47,32.57
  Top 1.27: 77.5,32.3 75.73,32.3
  Top 2.54: R4.1 104.7,45.9 107.8,42.8 107.8,38.1 105.5,35.8 102.4,35.8 99.2,32.6 77.8,32.6
  Bottom 1.016: v75.47,32.57 62.53,32.57 61.57,33.53 IC1.3
  Bottom 2.54: R5.2 114.4,41.4 | 114.4,41.4 113,41.4 | 113,41.4 111.5,41.4 | 111.5,41.4 110,41.4 105.5,45.9 R4.1 | C8.1 112.94,42.84 | 112.94,42.84 112.94,41.46 113,41.4 | 111.5,41.4 112.94,42.84 | 112.94,42.84 112.96,42.84 114.4,41.4
N$10
  Bottom 1.016: R6.3 R6.2 102,43.6 R5.1
N$11
  Bottom 1.016: U3.1 105.2,56.3 | 105.2,56.3 105.2,55.4 | 105.2,55.4 U3.3 | 105.2,54.2 U3.3 | 105.2,55.4 105.1,55.5 104.3,55.5 | 101,55.5 96.6,55.5 94.4,53.3 94.4,38.2 93.1,36.9 66.6,36.9 65.6,37.9 60.3,37.9 59.03,36.63 IC1.2 | 101,55.5 102.1,55.5 | 102.1,55.5 102.6,55.5 | 102.6,55.5 104.3,55.5 | R7.1 101.9,56.4 | 101.9,56.4 101.9,55.7 102.1,55.5 | 104.3,55.5 105.1,56.3 105.2,56.3 | 104.3,55.5 105.07,54.73 U3.3 | 101,55.5 101.9,56.4 | 101.9,56.4 102.6,55.7 102.6,55.5
N$12  (via drill 1)
  Top 1.016: R9.2 99.2,54 98.3,54.9 95.3,54.9 94.4,54 94.4,39.6 93.1,38.3 71.2,38.3 70.6,38.9 v70.6,39.5
  Bottom 1.016: IC1.6 61.5,43.54 61.5,42.4 62.2,41.7 69.6,41.7 70.6,40.7 v70.6,39.5
N$15
  Bottom 1.016: PC817.1 100.83,63.73 99.2,62.1 R9.1
N$17
  Bottom 1.016: Q2.2 86,18.69 | 86,18.69 R12.2 R11.2 85.3,19.39 86,18.69
N$18  (1 unrouted)
  Bottom 1.016: Q2.1 88.1,15 89.5,16.4 R13.1
  Bottom 2.6: R13.1 92.3,19.49 | D4.1 92.7,19.89 92.3,19.49 | 92.3,19.49 104.79,19.49 106.8,21.5 106.8,22.8 106.8,24.3
N$19
  Bottom 2.3: 104,28 104,24.46 U4.2
  Bottom 2.6: 104,28 106.7,30.7 XT30.P
PA4  (via drill 1)
  Top 1.016: v48.1,8.8 79.9,8.8 82,10.9 82,27.8 83.6,29.4 104.1,29.4 111,36.3 111,43.9 104.1,50.8 104.1,53 99.8,57.3 94.1,57.3 92.3,59.1 v92.3,66
  Bottom 1.016: U$3.PA4 48,12.63 48,8.9 v48.1,8.8 | v92.3,66 92.57,66.27 PC817.3
PA12  (via drill 1)
  Top 1.016: v46,33 49.1,33 50.6,34.5 50.6,37.44 48.54,39.5 48.54,43.6 49.74,44.8 v49.74,46.4
  Bottom 1.016: U$3.PA12 53.06,31.04 51.1,33 v46,33 | v49.74,46.4 49.74,47.76 48.67,48.83 U2.3
PA15
  Bottom 1.016: U$3.PA15 50.52,30.38 50.2,30.7 43.9,30.7 43.3,31.3 R1.1
PB1
  Bottom 1.016: X2.2 53.33,7.93 54.2,8.8 59.9,8.8 60.68,9.58 U$3.PB1
RX1  (via drill 1)
  Top 1.016: v66.8,23.43 66.8,16.8 68.3,15.3 75.4,15.3 76.5,14.2 v76.5,13.13 76.5,13.1
  Bottom 0.813: v76.5,13.13 76.6,13.03 76.6,4.8 75.9,4.1 41.7,4.1 41.1,4.7 41.1,7.7 40.4,8.4 37.1,8.4 36.6,7.9 X3.2
  Bottom 1.016: U$3.PA10 58.14,26.36 61,23.5 66.73,23.5 v66.8,23.43
RX2  (via drill 1)
  Top 0.813: v45,8.79 29.69,8.79 28.6,7.7 v28.6,5.9
  Bottom 0.813: v28.6,5.9 23.04,5.9 X4.1 | v45,8.79 v45,8.8
  Bottom 1.016: v45,8.79 45.44,9.23 U$3.PA3
SCL1  (via drill 1)
  Top 1.016: v84.2,64.9 84.2,65.6 84.7,66.1 88.3,66.1 89.5,67.3 89.5,73.1 88.2,74.4 38.7,74.4 37.5,73.2 37.5,58.3 36.2,57 13.5,57 12.3,55.8 12.3,11.9 13.2,11 22.1,11 23.2,12.1 23.2,14.9 23.9,15.6 33.1,15.6 33.9,16.4 v33.9,20.7
  Bottom 1.016: U$3.PB6 40.36,22.06 39,20.7 v33.9,20.7 | v84.2,64.9 83.97,65.13 VOLTAGE-DISPLAY.3
SDA1  (via drill 1)
  Top 1.016: v86.5,71.6 49,71.6 43.4,66 43.4,54.3 42,52.9 16,52.9 14.7,51.6 14.7,14.1 15.6,13.2 20.9,13.2 21.4,13.7 21.4,17.8 22.1,18.5 31,18.5 31.7,19.2 31.7,22.9 32.4,23.6 v33.8,23.6
  Bottom 1.016: U$3.PB7 37.82,24.32 37,23.5 33.8,23.5 v33.8,23.6 | v86.5,71.6 v86.51,71.59 VOLTAGE-DISPLAY.4
SWCLK
  Bottom 1.016: X1.2 18.5,18.33 23.53,18.33 24.3,19.1 24.3,24.7 23.42,25.58 SV1.2
SWDIO
  Bottom 1.016: X1.3 16.13,20.77 15.6,21.3 15.6,22.4 14.96,23.04 SV1.4
TX1  (via drill 1)
  Top 1.016: v69.9,23.5 69.9,18.2 71.1,17 77.7,17 v77.9,16.8
  Bottom 0.813: X3.1 39.14,3.56 39.7,3 77.3,3 78.6,4.3 78.6,16.1 v77.9,16.8
  Bottom 1.016: U$3.PA9 60.68,26.62 62.1,25.2 68.4,25.2 70,23.6 70,23.5 v69.9,23.5
TX2
  Bottom 0.813: U$3.PA2 42.9,10.9 41.86,9.86 21.75,9.86 20.4,8.5 X4.2
VCAP
  Top 2.6: R13.2 89.5,23.4 92.1,20.8 99.8,20.8 | 99.8,20.8 101.7,20.8 | 101.7,20.8 102.9,20.8 | 102.9,20.8 115.6,20.8 120.02,25.22 120.02,42.18 117,45.2 R4.2 | U4.3 101.42,22.8 | 101.42,22.8 101.42,21.08 101.7,20.8 | 101.42,22.8 99.8,21.18 99.8,20.8 | 101.42,22.8 102.9,21.32 102.9,20.8
  Bottom 2.4: 99.01,24.7 99.31,24.4 U4.3
  Bottom 2.54: MUR1560.1 114.84,77.2 114.84,66.66 118.2,63.3 U$4.+ 125.7,63.3 128,61 128,47.7 126.3,46 U$5.+ 117.1,46 R4.2 | 99.01,24.7 95.51,28.2 90.59,28.2 R13.2
VOUT-TO-BOOST
  Bottom 2.1: U1.6 59.83,60.93 62.54,63.64 KF25_2PIN4.P1

### Text on the board
tNames: IN BOOST | OUT BOOST | 16V | GNDREF | BOOST | GND | TLP250 | 100nF | MP1584 5V | 450V ELCO | 12V | OLED 128 x 32 | FUSE 2A | TLP250 | 100nF | 6.2 Ohm | FAN 12V | 1K Ohm | SOLENOID | 100nF | 100nF | 100nF | 100uF | ON | 330 | 330 | CA3140 | 470uF | 470uF | OFF | STLINK | IRF840 | 1K | 10K 50W Wirewound Resistor | 2K | IDC ST LINK V2 | DGND | TX1 | RX1 | PB1 | DGND | KRSBI MEGAPORA 2024 | DGND | TX2 | RX2 | SOLENOID KICKER CONTROLLER | DON'T RUN BOOST AND TRIGGER AT SAME TIME | USART1 | USART2 | VOLTAGE SENSOR